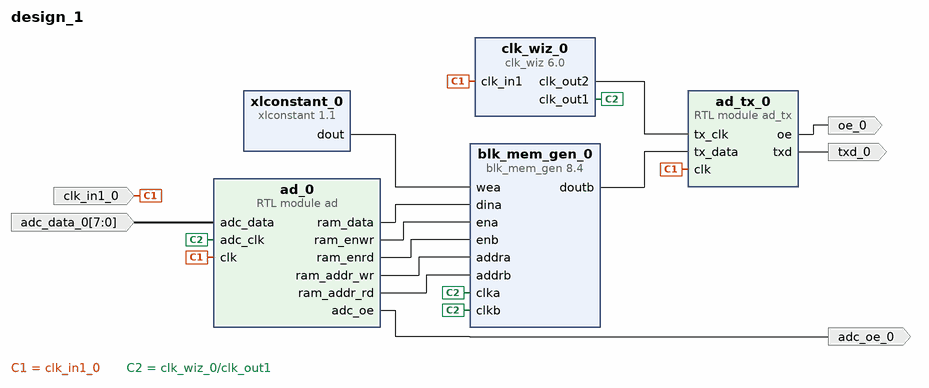
[diagram p0: block diagram of the top level]
# Vivado block design design_1, xc7s15ftgb196-1, Vivado 2018.2
create_bd_design design_1

create_bd_port -dir I -type clk clk_in1_0
set_property -dict {CONFIG.CLK_DOMAIN clk_100M} [get_bd_ports clk_in1_0]
create_bd_port -dir I -from 7 -to 0 adc_data_0
create_bd_port -dir O adc_oe_0
create_bd_port -dir O txd_0
create_bd_port -dir O oe_0

create_bd_cell -type ip -vlnv xilinx.com:ip:clk_wiz:6.0 clk_wiz_0
set_property -dict [list \
  CONFIG.CLKOUT2_USED true \
  CONFIG.NUM_OUT_CLKS 2 \
  CONFIG.CLKOUT1_REQUESTED_OUT_FREQ 15.000 \
  CONFIG.CLKOUT2_REQUESTED_OUT_FREQ 120.000 \
  CONFIG.USE_LOCKED false \
  CONFIG.USE_RESET false \
  CONFIG.MMCM_DIVCLK_DIVIDE 5 \
  CONFIG.MMCM_CLKFBOUT_MULT_F 48.000 \
  CONFIG.MMCM_CLKOUT0_DIVIDE_F 64.000 \
  CONFIG.MMCM_CLKOUT1_DIVIDE 8 \
  CONFIG.CLKOUT1_JITTER 349.742 \
  CONFIG.CLKOUT1_PHASE_ERROR 301.601 \
  CONFIG.CLKOUT2_JITTER 245.813 \
  CONFIG.CLKOUT2_PHASE_ERROR 301.601 \
] [get_bd_cells clk_wiz_0]
create_bd_cell -type ip -vlnv xilinx.com:ip:blk_mem_gen:8.4 blk_mem_gen_0
set_property -dict [list \
  CONFIG.Memory_Type Simple_Dual_Port_RAM \
  CONFIG.Enable_32bit_Address false \
  CONFIG.Use_Byte_Write_Enable false \
  CONFIG.Write_Width_A 8 \
  CONFIG.Write_Depth_A 512 \
  CONFIG.Operating_Mode_A NO_CHANGE \
  CONFIG.Write_Width_B 8 \
  CONFIG.Read_Width_B 8 \
  CONFIG.Enable_B Use_ENB_Pin \
  CONFIG.Register_PortB_Output_of_Memory_Primitives true \
  CONFIG.Port_B_Clock 100 \
  CONFIG.Port_B_Enable_Rate 100 \
  CONFIG.use_bram_block Stand_Alone \
] [get_bd_cells blk_mem_gen_0]
create_bd_cell -type ip -vlnv xilinx.com:ip:xlconstant:1.1 xlconstant_0
create_bd_cell -type module -reference ad_tx ad_tx_0
create_bd_cell -type module -reference ad ad_0

# ---- connections ----

connect_bd_net -net clk_in1_0_1 [get_bd_ports clk_in1_0] [get_bd_pins clk_wiz_0/clk_in1] [get_bd_pins ad_tx_0/clk] [get_bd_pins ad_0/clk]
connect_bd_net [get_bd_pins clk_wiz_0/clk_out1] [get_bd_pins blk_mem_gen_0/clka] [get_bd_pins ad_0/adc_clk] [get_bd_pins blk_mem_gen_0/clkb]
connect_bd_net [get_bd_pins blk_mem_gen_0/doutb] [get_bd_pins ad_tx_0/tx_data]
connect_bd_net [get_bd_pins ad_0/ram_data] [get_bd_pins blk_mem_gen_0/dina]
connect_bd_net -net adc_data_0_1 [get_bd_ports adc_data_0] [get_bd_pins ad_0/adc_data]
connect_bd_net [get_bd_pins ad_0/adc_oe] [get_bd_ports adc_oe_0]
connect_bd_net [get_bd_pins ad_tx_0/txd] [get_bd_ports txd_0]
connect_bd_net [get_bd_pins xlconstant_0/dout] [get_bd_pins blk_mem_gen_0/wea]
connect_bd_net [get_bd_pins ad_tx_0/oe] [get_bd_ports oe_0]
connect_bd_net [get_bd_pins ad_0/ram_enwr] [get_bd_pins blk_mem_gen_0/ena]
connect_bd_net [get_bd_pins ad_0/ram_enrd] [get_bd_pins blk_mem_gen_0/enb]
connect_bd_net [get_bd_pins ad_0/ram_addr_wr] [get_bd_pins blk_mem_gen_0/addra]
connect_bd_net [get_bd_pins ad_0/ram_addr_rd] [get_bd_pins blk_mem_gen_0/addrb]
connect_bd_net [get_bd_pins clk_wiz_0/clk_out2] [get_bd_pins ad_tx_0/tx_clk]

validate_bd_design
save_bd_design
